# EAGLE design BPW5011-SPI-ADC (EAGLE 5.11)
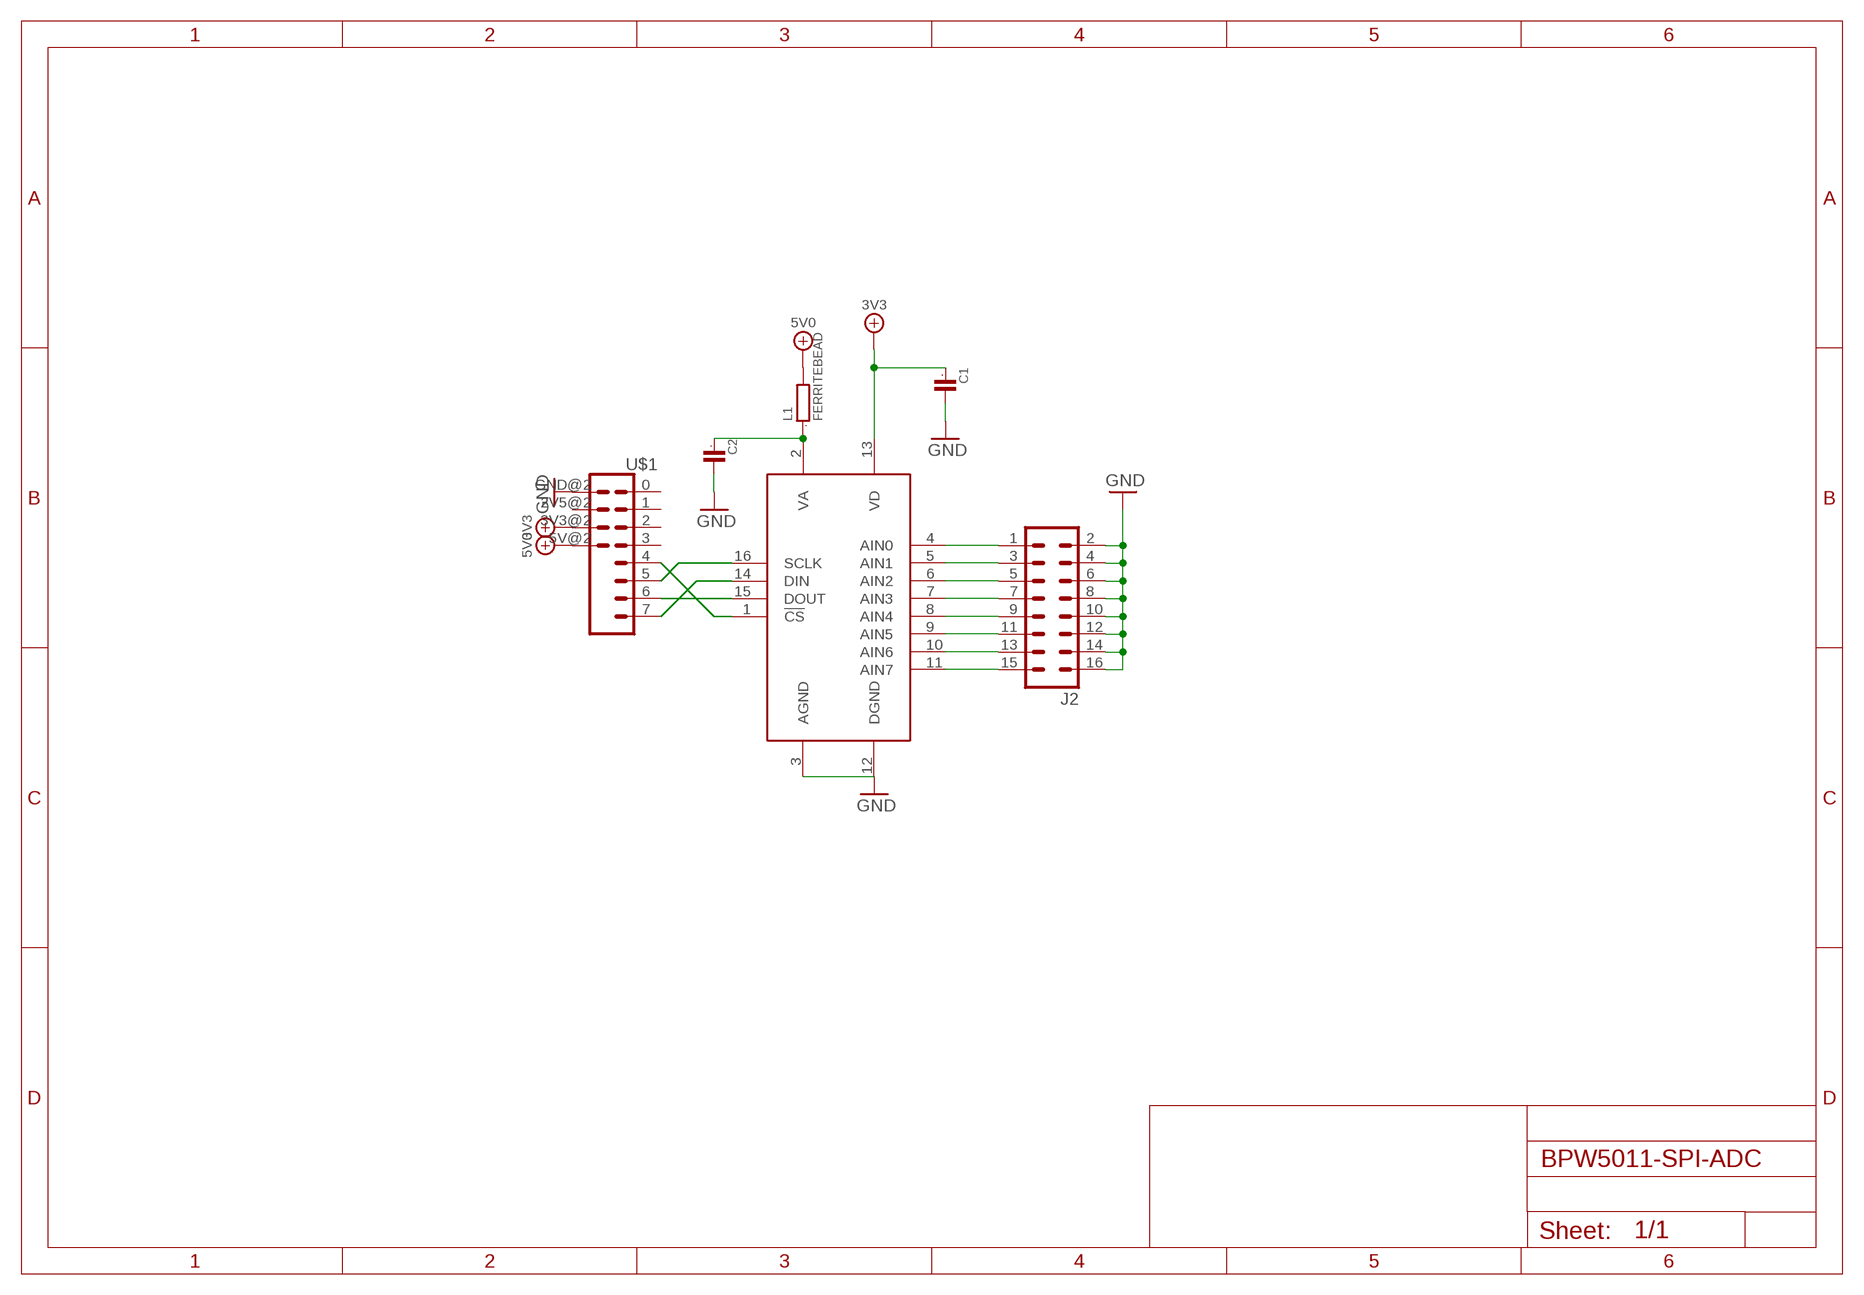
[diagram p0: schematic, sheet 1]

## Parts
C1  C0603  [0603]
C2  C0603  [0603]
J2  MA08-2  [MA08-2]
L1  FERRITEBEAD  R0603  [0603]
U1  ADC088S102CIMT  [TSSOP16]
U$1  WING8WING8_NOHOLES  [WINGSIDE_8BIT_NOHOLES]

## Nets
3V3: C1.1 U1.13(VD) U$1.3V3@2(3V3)
5V0: L1.2 U$1.5V@2(5V)
GND: C1.2 C2.2 J2.2 J2.4 J2.6 J2.8 J2.10 J2.12 J2.14 J2.16 U1.3(AGND) U1.12(DGND) U$1.GND@2(GND)
N$1: J2.1 U1.4(AIN0)
N$2: J2.3 U1.5(AIN1)
N$3: J2.5 U1.6(AIN2)
N$4: J2.7 U1.7(AIN3)
N$5: J2.9 U1.8(AIN4)
N$6: J2.11 U1.9(AIN5)
N$7: J2.13 U1.10(AIN6)
N$8: J2.15 U1.11(AIN7)
N$9: C2.1 L1.1 U1.2(VA)
N$10: U1.1(!CS) U$1.4
N$11: U1.15(DOUT) U$1.6
N$13: U1.16(SCLK) U$1.5
N$14: U1.14(DIN) U$1.7
Unconnected: U$1.0 U$1.1 U$1.2 U$1.2V5@2(2V5) U$1.3

## Library data of the parts
C1 C2 = GadgetFactory:C: CAPACITOR, European symbol
J2 = con-lstb:MA08-2: PIN HEADER
L1 = GadgetFactory:R: RESISTOR, European symbol
U1 = spiadc:ADC088S102
U$1 = Papilio:WING8

## Board
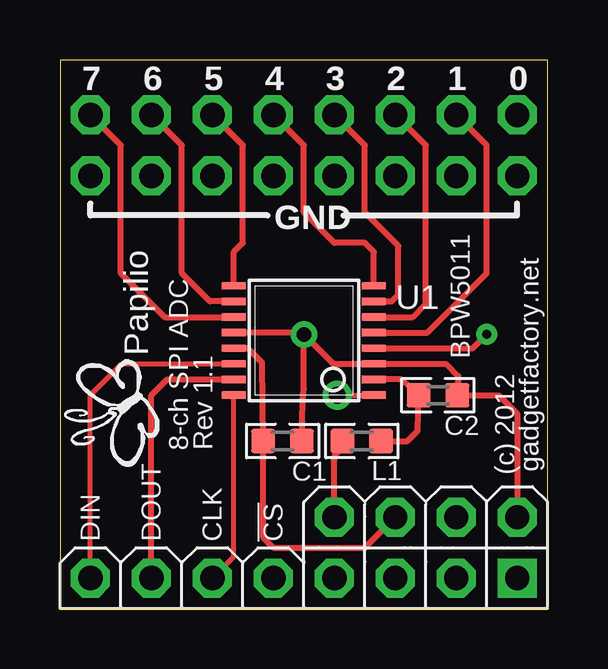
[diagram p1: board, top side]
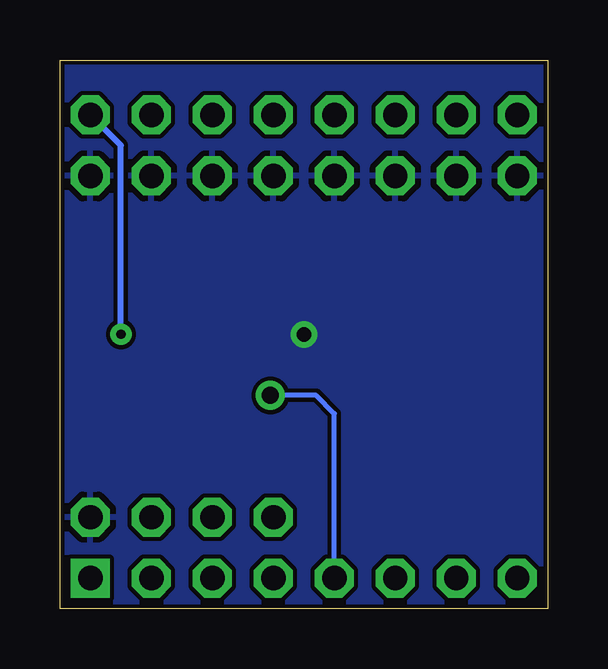
[diagram p2: board, bottom side, seen from below]

Size 20.32 x 22.86 mm. Coordinates in mm from the lower left corner, seen from the top.
Outline: 0,0 20.32,0 20.32,22.86 0,22.86 0,0
Copper layers (1*16): Top 0.035mm / dielectric 1.5mm / Bottom 0.035mm
Design rules "SparkFun_Derived_GoldePheonix_7mil": minimum track width 7mil, minimum drill 15mil, track to track 7mil, track to pad 7mil, pad to pad 7mil, via to via 7mil, smd to smd 7mil, copper to edge 7mil, drill to drill 7mil, minimum pad ring 12mil, minimum via ring 10mil, stop-mask expansion 4mil, vias tented up to drill 18mil, thermal gap 10mil

### Footprints (pad centres in the part's own frame; a part is rotated, then mirrored left to right if it is on the bottom)
0603 = smd 1 x 1: 1 -0.8,0; 2 0.8,0
MA08-2 = drill 1.016 octagon: 1 -8.89,-1.27; 2 -8.89,1.27; 3 -6.35,-1.27; 4 -6.35,1.27; 5 -3.81,-1.27; 6 -3.81,1.27; 7 -1.27,-1.27; 8 -1.27,1.27; 9 1.27,-1.27; 10 1.27,1.27; 11 3.81,-1.27; 12 3.81,1.27; 13 6.35,-1.27; 14 6.35,1.27; 15 8.89,-1.27; 16 8.89,1.27
TSSOP16 = smd 0.305 x 0.991: 1 -2.275,-2.918; 2 -1.625,-2.918; 3 -0.975,-2.918; 4 -0.325,-2.918; 5 0.325,-2.918; 6 0.975,-2.918; 7 1.625,-2.918; 8 2.275,-2.918; 9 2.275,2.918; 10 1.625,2.918; 11 0.975,2.918; 12 0.325,2.918; 13 -0.325,2.918; 14 -0.975,2.918; 15 -1.625,2.918; 16 -2.275,2.918
WINGSIDE_8BIT_NOHOLES = drill 1.016 square: 0 19.05,1.27 | drill 1.016 octagon: 1 16.51,1.27; 2 13.97,1.27; 2V5@2 16.51,3.81; 3 11.43,1.27; 3V3@2 13.97,3.81; 4 8.89,1.27; 5 6.35,1.27; 5V@2 11.43,3.81; 6 3.81,1.27; 7 1.27,1.27; GND@2 19.05,3.81

### Placement (x,y rotation side)
C1  9.27,6.99 0 top
C2  15.75,8.89 0 top
J2  10.16,19.3 180 top
L1  12.57,6.99 180 top
U1  10.16,11.18 90 top
U$1  0,0 0 top
U$2  [GADGETFACTORY_LOGO]  4.7,5.71 90 top

### Tracks (layer width: path | path; a pad name or v marks a point on that pad's centre or on a via)
3V3
  Top 0.254: U1.13 7.82,10.85 8.42,10.25 C1.1 8.47,2.96 8.89,2.54 12.7,2.54 U$1.3V3@2
5V0
  Top 0.254: L1.2 11.77,6.69 11.43,6.35 U$1.5V@2
GND  (via drill 0.6)
  Top 0.254: C1.2 10.12,8.68 10.16,9.14 v10.16,11.43 | U1.12 10.09,11.5 v10.16,11.43 | v10.16,11.43 11.39,10.2 U1.3 16.09,10.2 16.6,9.69 C2.2 18.29,8.89 19.05,8.13 U$1.GND@2
  Bottom 0.254: v10.16,11.43 10.16,11.3
  pour Bottom: 0,22.86 20.32,22.86 20.32,0 0,0
N$1  (via drill 0.38)
  Top 0.254: U1.4 17.2,10.85 v17.78,11.43
  Bottom 0.254: v17.78,11.43 17.78,19.3 J2.1
N$2
  Top 0.254: J2.3 17.78,19.3 17.78,13.97 15.31,11.5 U1.5
N$3
  Top 0.254: U1.6 14.69,12.15 15.24,12.7 15.24,19.3 J2.5
N$4
  Top 0.254: U1.7 13.82,12.8 14.1,13.08 14.1,15.11 12.7,16.51 12.7,19.3 J2.7
N$5
  Top 0.254: U1.8 13.08,14.86 12.7,15.24 11.43,15.24 10.16,16.51 10.16,19.3 J2.9
N$6
  Top 0.254: U1.9 7.24,14.86 7.62,15.24 7.62,19.3 J2.11
N$7
  Top 0.254: U1.10 6.25,12.8 5.08,13.97 5.08,19.3 J2.13
N$8
  Top 0.254: U1.11 4.36,12.15 2.54,13.97 2.54,19.3 J2.15
N$9
  Top 0.254: L1.1 14.48,6.99 14.9,7.41 C2.1 14.24,9.55 U1.2
N$10  (via drill 0.7)
  Top 0.203: U1.1 v11.57,8.9 v11.56,8.89
  Bottom 0.203: v11.56,8.89 9.65,8.89 8.89,8.13 U$1.4
N$11
  Top 0.254: U1.15 4.47,9.55 3.81,8.89 U$1.6
N$13
  Top 0.203: U1.16 7.24,2.16 U$1.5
N$14
  Top 0.203: U1.14 2.58,10.2 1.27,8.89 U$1.7

### Text on the board
tPlace: 7 | 6 | 5 | 4 | 3 | 2 | 1 | 0 | GND | BPW5011 | Papilio | 8-ch SPI ADC | Rev 1.1 | (c) 2012 | gadgetfactory.net | DIN | DOUT | CLK | !CS